# EAGLE design 7inLED-cntr-J010130C (EAGLE 7.7.0)
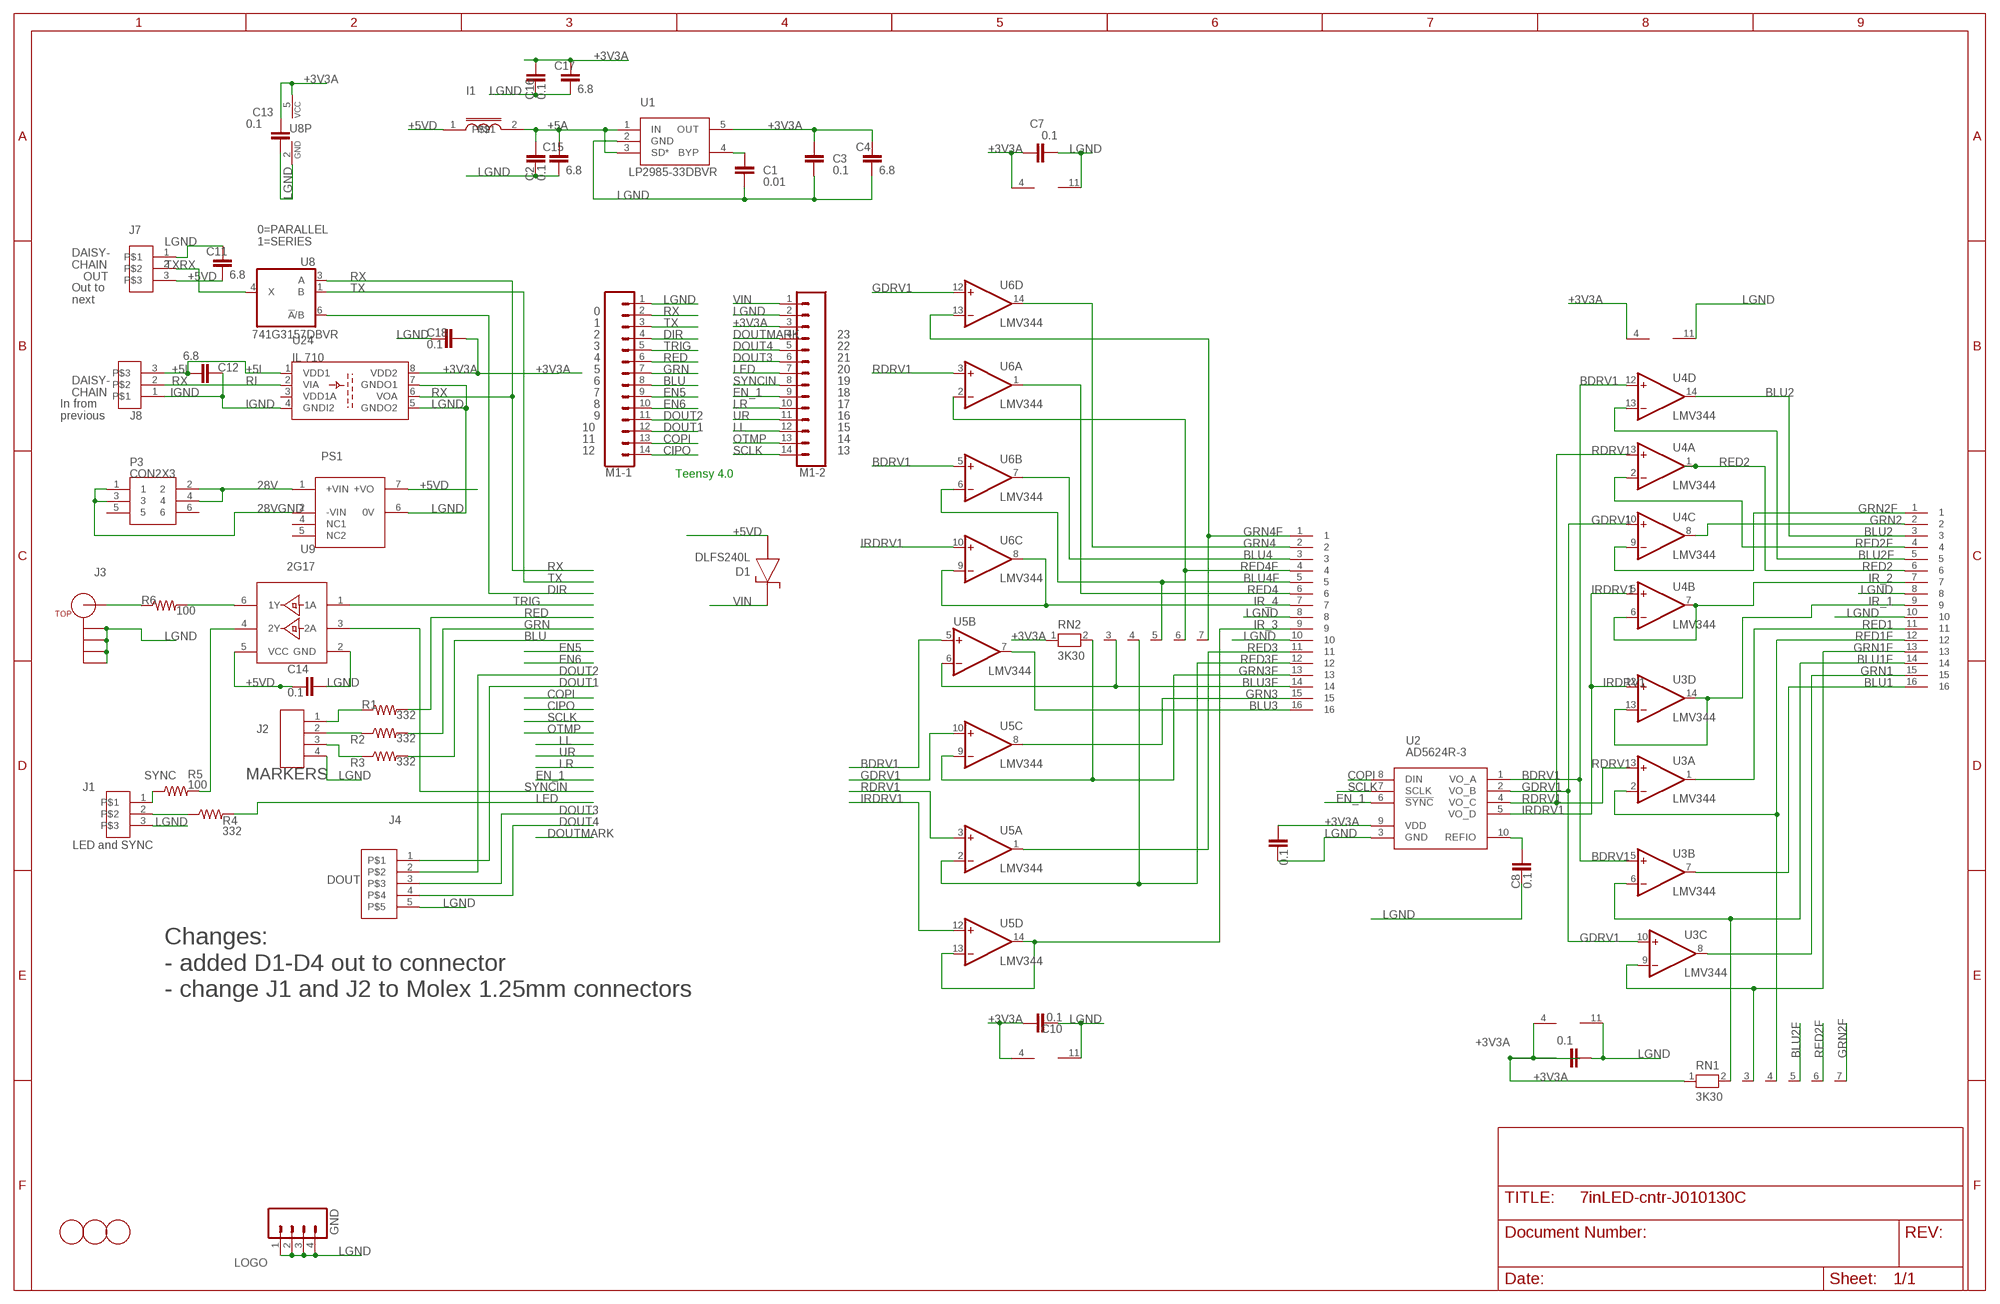
[diagram p0: schematic, sheet 1]

## Parts
C1  0.01  CAPS0805S  [0805S]
C2  0.1  CAPS0603S  [0603S]
C3  0.1  CAPS0603S  [0603S]
C4  6.8  CAPS1206S  [1206S]
C5  0.1  CAPS0603S  [0603S]
C7  0.1  CAPS0603S  [0603S]
C8  0.1  CAPS0603S  [0603S]
C9  0.1  CAPS0603S  [0603S]
C10  0.1  CAPS0603S  [0603S]
C11  6.8  CAPS1210S  [1210S]
C12  6.8  CAPS1210S  [1210S]
C13  0.1  CAPS0603S  [0603S]
C14  0.1  CAPS0603S  [0603S]
C15  6.8  CAPS1206S  [1206S]
C16  0.1  CAPS0603S  [0603S]
C17  6.8  CAPS1206S  [1206S]
C18  0.1  CAPS0603S  [0603S]
D1  DLFS240L  DIODE_SCHOTTKYPWRDI-123  [PWRDI-123]
FID1  FIDUCIAL  [FIDUCIAL_1MM]
FID2  FIDUCIAL  [FIDUCIAL_1MM]
FID3  FIDUCIAL  [FIDUCIAL_1MM]
GND  M04LOCK  [1X04_LOCK]
I1  INDUCTOR0805S  [0805S]
J1  CON3DF13-3TH  [DF13-3P-TH]
J2  CON4DF13-4-TH  [DF13-4-TH]
J3  BNC-4PADBNC-5-1634503-1  [5-1634503-1]
J4  CON5AMPMODU-5  [AMPMODU-5]
J7  CON3AMPMODU-3  [AMPMODU-3]
J8  CON3AMPMODU-3  [AMPMODU-3]
M1-1  CONN_14  [1X14]
M1-2  CONN_14  [1X14]
P1  CON162X8PLUG  [2X8_PLUG]
P2  CON162X8PLUG  [2X8_PLUG]
P3  CON2X3  [2X3_PLUG]
PS1  DC-DCISLTDN-5W  [DC-DC-TDN-5W]
R1  332  RESISTOR_SM0805S  [0805S]
R2  332  RESISTOR_SM0805S  [0805S]
R3  332  RESISTOR_SM0805S  [0805S]
R4  332  RESISTOR_SM0805S  [0805S]
R5  100  RESISTOR_SM0805S  [0805S]
R6  100  RESISTOR_SM0805S  [0805S]
RN1  3K30  RN06  [RN-7]
RN2  3K30  RN06  [RN-7]
U1  LP2985-33DBVR  LT1761-5-SOT23  [SOT23-5]
U2  AD5624R-3  AD56X4R  [MSOP10]
U3  LMV344  QUAD_OPAMPD  [SO14]
U4  LMV344  QUAD_OPAMPD  [SO14]
U5  LMV344  QUAD_OPAMPD  [SO14]
U6  LMV344  QUAD_OPAMPD  [SO14]
U8  741G3157DBVR  [DBV_R-PDSO-G6]
U9  2G17  [SOT23-6]
U24  IL 710  ADUM1100IL710  [MSOP08]
U$2  JFRC-LOGOLOGO_OP  [LOGO_BMP_OP]

## Nets
28V: P3.2 P3.4 PS1.1(+VIN)
28VGND: P3.1 P3.3 PS1.2(-VIN)
+3V3A: C3.1 C4.1 C5.1 C7.1 C9.1 C10.1 C13.1 C16.1 C17.1 C18.1 M1-2.3 RN1.1 RN2.1 U1.5(OUT) U2.9(VDD) U3.4(P:V+) U4.4(P:V+) U5.4(P:V+) U6.4(P:V+) U8.5(VCC) U24.8(VDD2)
+5A: C2.1 C15.1 I1.2 U1.1(IN) U1.3(SD*)
+5I: C12.1 J8.3 U24.1(VDD1)
+5VD: C11.2 C14.1 D1.A I1.1 J7.3 PS1.7(+VO) U9.5(VCC)
BDRV1: U2.1(VO_A) U3.5(B:+IN) U4.12(D:+IN) U5.5(B:+IN) U6.5(B:+IN)
BLU: M1-1.8 R3.2
BLU1: P1.16 U3.7(B:OUT)
BLU1F: P1.14 RN1.2 U3.6(B:-IN)
BLU2: P1.3 U4.14(D:OUT)
BLU2F: P1.5 RN1.5 U4.13(D:-IN)
BLU3: P2.16 U5.7(B:OUT)
BLU3F: P2.14 RN2.3 U5.6(B:-IN)
BLU4: P2.3 U6.7(B:OUT)
BLU4F: P2.5 RN2.5 U6.6(B:-IN)
CIPO: M1-1.14
COPI: M1-1.13 U2.8(DIN)
DIR: M1-1.4 U8.6(!A!/B)
DOUT1: J4.1 M1-1.12
DOUT2: J4.2 M1-1.11
DOUT3: J4.3 M1-2.6
DOUT4: J4.4 M1-2.5
DOUTMARK: M1-2.4
EN5: M1-1.9
EN6: M1-1.10
EN_1: M1-2.9 U2.6(!SYNC)
GDRV1: U2.2(VO_B) U3.10(C:+IN) U4.10(C:+IN) U5.10(C:+IN) U6.12(D:+IN)
GRN: M1-1.7 R2.2
GRN1: P1.15 U3.8(C:OUT)
GRN1F: P1.13 RN1.3 U3.9(C:-IN)
GRN2: P1.2 U4.8(C:OUT)
GRN2F: P1.1 RN1.7 U4.9(C:-IN)
GRN3: P2.15 U5.8(C:OUT)
GRN3F: P2.13 RN2.2 U5.9(C:-IN)
GRN4: P2.2 U6.14(D:OUT)
GRN4F: P2.1 RN2.7 U6.13(D:-IN)
IGND: C12.2 J8.1 U24.4(GNDI2)
IR_1: P1.9 U3.13(D:-IN) U3.14(D:OUT)
IR_2: P1.7 U4.6(B:-IN) U4.7(B:OUT)
IR_3: P2.9 U5.13(D:-IN) U5.14(D:OUT)
IR_4: P2.7 U6.8(C:OUT) U6.9(C:-IN)
IRDRV1: U2.5(VO_D) U3.12(D:+IN) U4.5(B:+IN) U5.12(D:+IN) U6.10(C:+IN)
LED: M1-2.7 R4.2
LGND: C1.2 C2.2 C3.2 C4.2 C5.2 C7.2 C8.2 C9.2 C10.2 C11.1 C13.2 C14.2 C15.2 C16.2 C17.2 C18.2 GND.1 GND.2 GND.3 GND.4 J1.3 J2.4 J3.2A(S1) J3.2B(S2) J3.2C(S3) J3.2D(S4) J4.5 J7.1 M1-1.1 M1-2.2 P1.8 P1.10 P2.8 P2.10 PS1.6(0V) U1.2(GND) U2.3(GND) U3.11(P:V-) U4.11(P:V-) U5.11(P:V-) U6.11(P:V-) U8.2(GND) U9.2(GND) U24.5(GNDO2) U24.7(GNDO1)
LL: M1-2.12
LR: M1-2.10
N$2: R6.2 U9.6(1Y)
N$3: R5.2 U9.4(2Y)
N$4: J2.3 R3.1
N$5: C8.1 U2.10(REFIO)
N$12: C1.1 U1.4(BYP)
N$13: J2.2 R2.1
N$14: J2.1 R1.1
N$15: J3.1(C) R6.1
N$376: J1.2 R4.1
OTMP: M1-2.13
RDRV1: U2.4(VO_C) U3.3(A:+IN) U4.3(A:+IN) U5.3(A:+IN) U6.3(A:+IN)
RED: M1-1.6 R1.2
RED1: P1.11 U3.1(A:OUT)
RED1F: P1.12 RN1.4 U3.2(A:-IN)
RED2: P1.6 U4.1(A:OUT)
RED2F: P1.4 RN1.6 U4.2(A:-IN)
RED3: P2.11 U5.1(A:OUT)
RED3F: P2.12 RN2.4 U5.2(A:-IN)
RED4: P2.6 U6.1(A:OUT)
RED4F: P2.4 RN2.6 U6.2(A:-IN)
RI: J8.2 U24.2(VIA)
RX: M1-1.2 U8.3(A) U24.6(VOA)
SCLK: M1-2.14 U2.7(SCLK)
SYNC: J1.1 R5.1
SYNCIN: M1-2.8 U9.3(2A)
TRIG: M1-1.5 U9.1(1A)
TX: M1-1.3 U8.1(B)
TXRX: J7.2 U8.4(X)
UR: M1-2.11
VIN: D1.K M1-2.1
Unconnected: P3.5 P3.6 PS1.4(NC1) PS1.5(NC2) U24.3(VDD1A)

## Notes on the sheet
- 0=PARALLEL
  1=SERIES
- DAISY-
  CHAIN
- OUT
- Out to 
  next
- 0
- 1
- 2 | 23
- 3 | 22
- 4 | 21
- 5 | 20
- 6 | 19
- DAISY-
  CHAIN
- 7 | 18
- 8 | 17
- In from 
  previous
- 9 | 16
- 10 | 15
- 11 | 14
- 12 | 13
- Teensy 4.0
- MARKERS
- LED and SYNC
- DOUT
- Changes:
  - added D1-D4 out to connector
  - change J1 and J2 to Molex 1.25mm connectors

## Library data of the parts
C1-C5 C7-C18 = STEVES_BU:CAPS
D1 = STEVES_BU:DIODE_SCHOTTKY
FID1-FID3 = adafruit:FIDUCIAL: For use by pick and place machines to calibrate the vision/machine, 1mm By microbuilder.eu
GND = SparkFun:M04: Header 4 Standard 4-pin 0.1" header. Use with straight break away headers (SKU : PRT-00116), right angle break away headers (PRT-00553), swiss pins (PRT-00743), machine pins (PRT-00117), and female headers (PRT-00115). Molex polarized connector foot print use with SKU : PRT-08231 with associated crimp pins and housings.
I1 = STEVES:INDUCTOR
J1 = STEVES_BU:CON3
J2 = STEVES_BU:CON4
J3 = STEVES_BU:BNC-4PAD
J4 = STEVES_BU:CON5
J7 J8 = STEVES_HOME:CON3
M1-1 M1-2 = SparkFun-Connectors:CONN_14: Multi connection point. Often used as Generic Header-pin footprint for 0.1 inch spaced/style header connections On any of the 0.1 inch spaced packages, you can populate with these: Break Away Headers - Straight <https://www.sparkfun.com/products/116> (PRT-00116) Break Away Male Headers - Right Angle <https://www.sparkfun.com/products/553> (PRT-00553) Female Headers <https://www.sparkfun.com/products/115> (PRT-00115) Break Away Headers - Machine Pin <https://www.sparkfun.com/products/117> (PRT-00117) Break Away Female Headers - Swiss Machine Pin <https://www.sparkfun.com/products/743> (PRT-00743) For SCREWTERMINALS and SPRING TERMINALS visit here: Screw Terimnals on SparkFun.com <https://www.sparkfun.com/search/results?term=Screw+Terminals> (5mm/3.5mm/2.54mm spacing) This device is also useful as a general connection point to wire up your design to another part of your project. Our various solder wires solder well into these plated through hole pads. Hook-Up Wire - Assortment (Stranded, 22 AWG) <https://www.sparkfun.com/products/11375> (PRT-11375) Hook-Up Wire - Assortment (Solid Core, 22 AWG) <https://www.sparkfun.com/products/11367> (PRT-11367) View the entire wire category on our website here <https://www.sparkfun.com/categories/141> Special notes: Molex polarized connector foot print use with SKU : PRT-08231 with associated crimp pins and housings. 1MM SMD Version SKU: PRT-10208 NOTES ON THE VARIANTS LOCK and LOCK_LONGPADS... This footprint was designed to help hold the alignment of a through-hole component (i.e. 6-pin header) while soldering it into place. You may notice that each hole has been shifted either up or down by 0.005 of an inch from it's more standard position (which is a perfectly straight line). This slight alteration caused the pins (the squares in the middle) to touch the edges of the holes. Because they are alternating, it causes a "brace" to hold the component in place. 0.005 has proven to be the perfect amount of "off-center" position when using our standard breakaway headers. Although looks a little odd when you look at the bare footprint, once you have a header in there, the alteration is very hard to notice. Also,if you push a header all the way into place, it is covered up entirely on the bottom side.
P1 P2 = STEVES_BU:CON16
P3 = STEVES_BU:CON2X3
PS1 = STEVES_BU:DC-DCISL
R1-R6 = STEVES_BU:RESISTOR_SM
RN1 RN2 = resistor-net:RN06: RESISTOR NETWORK; OC_FARNELL: unknown; OC_NEWARK: unknown
U1 = STEVES_HOME:LT1761-5-SOT23
U2 = STEVES_BU:AD56X4R
U3-U6 = adafruit:QUAD_OPAMP: OP AMP Standard quad package
U8 = 74xx-little-us:74*1G3157: Single-Pole, Double-Throw Analog Switch Source: http://focus.ti.com/lit/ds/symlink/sn74lvc1g3157.pdf
U9 = STEVES_BU:2G17
U24 = STEVES_BU:ADUM1100
U$2 = STEVES_BU:JFRC-LOGO

## Board
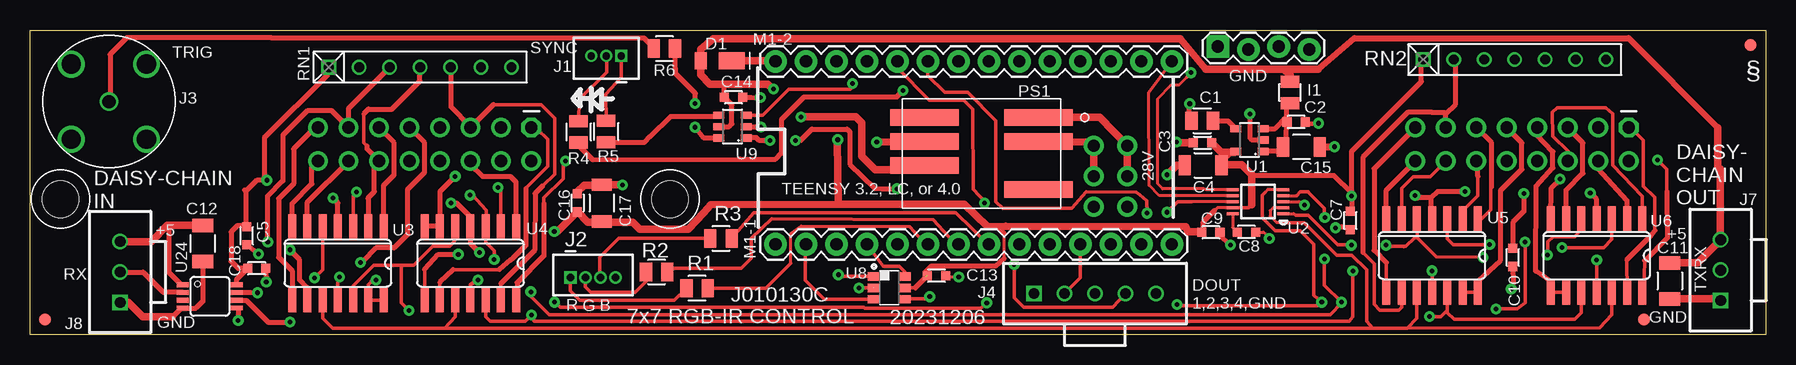
[diagram p1: board, top side]
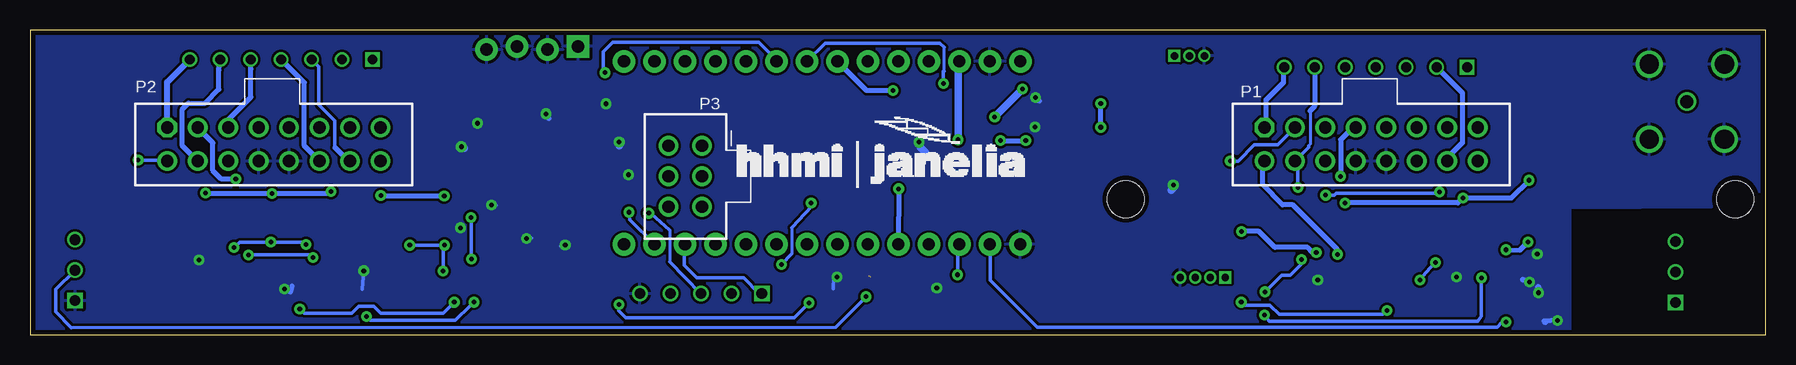
[diagram p2: board, bottom side, seen from below]

Size 144.65 x 25.4 mm. Coordinates in mm from the lower left corner, seen from the top.
Outline: 144.65,0 0,0 0,25.4 144.65,25.4 144.65,0
Copper layers (1*16): Top 0.068mm / dielectric 0.45mm / Bottom 0.068mm
Design rules "default *": minimum track width 8mil, minimum drill 12mil, track to track 8mil, track to pad 8mil, pad to pad 8mil, via to via 8mil, smd to smd 8mil, copper to edge 16mil, drill to drill 8mil, minimum pad ring 8mil, minimum via ring 10mil, stop-mask expansion 4mil, vias tented up to drill 25mil, thermal gap 10mil

### Footprints (pad centres in the part's own frame; a part is rotated, then mirrored left to right if it is on the bottom)
0805S = smd 1.016 x 1.524: 1 -0.889,0; 2 0.889,0
0603S = smd 0.762 x 0.762: 1 -0.762,0; 2 0.762,0
1206S = smd 1.016 x 1.651: 1 -1.524,0; 2 1.524,0
1210S = smd 1.14 x 1.75: 1 -1.5,0; 2 1.5,0
PWRDI-123 = smd 1 x 1.4: A 1.6,0 | smd 2.2 x 1.4: K -1,0
FIDUCIAL_1MM = smd 1 x 1: 1 0,0
1X04_LOCK = drill 1.016 pad 1.88 square: 1 0,0.127 | drill 1.016 pad 1.88: 2 2.54,-0.127; 3 5.08,0.127; 4 7.62,-0.127
DF13-3P-TH = drill 0.6 pad 0.889 square: 1 1.25,0 | drill 0.6 pad 0.889: 2 0,0; 3 -1.25,0
DF13-4-TH = drill 0.6 pad 0.889 square: 1 1.875,0 | drill 0.6 pad 0.889: 2 0.625,0; 3 -0.625,0; 4 -1.875,0
5-1634503-1 = drill 1.1: 1 0,0 | drill 1.6: 2A -3.13,3.13; 2B 3.13,3.13; 2C -3.13,-3.13; 2D 3.13,-3.13
AMPMODU-5 = drill 0.889 square: 1 -5.08,0 | drill 0.889: 2 -2.54,0; 3 0,0; 4 2.54,0; 5 5.08,0
AMPMODU-3 = drill 0.889 square: 1 -2.54,0 | drill 0.889: 2 0,0; 3 2.54,0
1X14 = drill 1.016 pad 1.88: 1 0,0; 2 2.54,0; 3 5.08,0; 4 7.62,0; 5 10.16,0; 6 12.7,0; 7 15.24,0; 8 17.78,0; 9 20.32,0; 10 22.86,0; 11 25.4,0; 12 27.94,0; 13 30.48,0; 14 33.02,0
2X8_PLUG = drill 1.016 pad 1.651 octagon: 1 -1.397,-8.89 | drill 1.016 pad 1.651: 2 1.397,-8.89; 3 -1.397,-6.35; 4 1.397,-6.35; 5 -1.397,-3.81; 6 1.397,-3.81; 7 -1.397,-1.27; 8 1.397,-1.27; 9 -1.397,1.27; 10 1.397,1.27; 11 -1.397,3.81; 12 1.397,3.81; 13 -1.397,6.35; 14 1.397,6.35; 15 -1.397,8.89; 16 1.397,8.89
2X3_PLUG = drill 1.016 pad 1.651: 1 -1.397,-2.54; 2 1.397,-2.54; 3 -1.397,0; 4 1.397,0; 5 -1.397,2.54; 6 1.397,2.54
DC-DC-TDN-5W = smd 5.7 x 1.4: 1 4.75,3; 2 4.75,1; 4 4.75,-3; 5 -4.75,3; 6 -4.75,1; 7 -4.75,-1
RN-7 = drill 0.813 square: 1 -7.62,0 | drill 0.813: 2 -5.08,0; 3 -2.54,0; 4 0,0; 5 2.54,0; 6 5.08,0; 7 7.62,0
4-40SOCKET = hole 3.048: 0,0
SOT23-5 = smd 0.6 x 0.9: 1 -0.95,-1.15; 2 0,-1.15; 3 0.95,-1.15; 4 0.95,1.15; 5 -0.95,1.15
MSOP10 = smd 0.25 x 1: 1 -1,-2.113; 2 -0.5,-2.113; 3 0,-2.113; 4 0.5,-2.113; 5 1,-2.113; 6 1,2.113; 7 0.5,2.113; 8 0,2.113; 9 -0.5,2.113; 10 -1,2.113
SO14 = smd 0.66 x 2.032: 1 -3.81,-3.073; 2 -2.54,-3.073; 3 -1.27,-3.073; 4 0,-3.073; 5 1.27,-3.073; 6 2.54,-3.073; 7 3.81,-3.073; 8 3.81,3.073; 9 2.54,3.073; 10 1.27,3.073; 11 0,3.073; 12 -1.27,3.073; 13 -2.54,3.073; 14 -3.81,3.073
DBV_R-PDSO-G6 = smd 0.69 x 0.99: 1 -0.95,-1.29; 2 0,-1.29; 3 0.95,-1.29; 4 0.95,1.3; 5 0,1.3; 6 -0.95,1.3
SOT23-6 = smd 0.6 x 0.9: 1 -0.95,-1.15; 2 0,-1.15; 3 0.95,-1.15; 4 0.95,1.15; 5 0,1.15; 6 -0.95,1.15
MSOP08 = smd 0.4 x 1: 1 -0.976,-2.263; 2 -0.326,-2.263; 3 0.324,-2.263; 4 0.974,-2.263; 5 0.974,2.262; 6 0.324,2.262; 7 -0.326,2.262; 8 -0.976,2.262

### Placement (x,y rotation side)
C1  97.69,17.83 180 top
C2  105.51,17.73 0 top
C3  97.71,16 180 top
C4  97.76,14.12 180 top
C5  18.06,8.25 270 top
C7  110.03,9.53 270 top
C8  101.37,8.56 0 top
C9  98.4,8.53 0 top
C10  123.57,6.45 270 top
C11  136.65,4.5 90 top
C12  14.4,7.62 270 top
C13  75.54,4.93 0 top
C14  58.62,19.79 0 top
C15  105.94,15.65 0 top
C16  45.62,11 90 top
C17  47.65,10.97 90 top
C18  18.9,5.54 0 top
D1  57.48,22.83 180 top
FID1  143.38,24.13 180 top
FID2  1.27,1.27 90 top
FID3  134.49,1.27 90 top
GND  98.98,23.9 0 top
I1  105,20.19 270 top
J1  48.03,23.24 0 top
J2  46.91,4.78 180 top
J3  6.58,19.43 0 top
J4  88.75,3.43 0 top
J7  140.89,5.38 90 top
J8  7.52,5.23 90 top
M1-1  62.13,7.54 0 top
M1-2  62.13,22.78 0 top
P1  32.89,15.87 270 bottom
P2  124.33,15.87 270 bottom
P3  90.04,13.21 180 bottom
PS1  79.3,15.11 0 top
R1  55.6,3.89 0 top
R2  52.22,5.23 0 top
R3  57.58,8.03 0 top
R4  45.72,16.92 270 top
R5  48.01,16.94 270 top
R6  52.86,23.85 0 top
RN1  32.51,22.3 0 top
RN2  123.72,22.94 0 top
S1  SCREW  [4-40SOCKET]  2.54,11.3 90 top
S8  SCREW  [4-40SOCKET]  53.34,11.3 90 top
U1  101.63,16.23 90 top
U2  102.34,11.1 90 top
U3  25.65,5.97 180 top
U4  36.7,5.97 180 top
U5  116.84,6.6 180 top
U6  130.56,6.6 180 top
U8  71.6,3.91 270 top
U9  58.55,17.35 90 top
U24  14.99,3.2 270 top
U$2  75.59,13.72 0 bottom

### Tracks (layer width: path | path; a pad name or v marks a point on that pad's centre or on a via)
28V
  Top 0.61: P3.4 P3.2 89.13,18.14 PS1.1
28VGND
  Top 0.61: P3.3 P3.1 88.25,16.06 PS1.2
+3V3A  (via drill 0.38)  (1 unrouted)
  Top 0.254: U2.9 98.94,10.6 98.7,10.36 | 81.18,6.38 81.18,8.46
  Top 0.305: U2.9 101.56,10.6 101.8,10.85 | U8.5 73.79,3.91
  Top 0.406: 98.7,10.36 98.7,10.34 97.74,9.37 97.74,8.64 C9.1 | 100.41,15.21 U1.5 | U3.4 25.65,11 v25.25,11.4 | 17.98,11.96 18.9,12.88 v19.74,12.88 19.53,13.08 19.53,16.41 24.84,21.72 24.84,22.25 RN1.1 | 17.98,11.96 17.98,9.09 | 17.98,9.09 C5.1 | v35.08,10.97 35.56,10.97 36.7,9.83 U4.4 36.7,7.62 v37.46,6.86 | U6.4 130.56,11.28 v130.02,11.81 | v124.48,11.79 124.48,10.29 123.57,9.37 C10.1 | v119.58,11.94 117.3,11.94 116.76,11.4 | 116.76,11.4 116.74,11.38 116.74,9.78 U5.4 | 116.76,11.4 115.62,11.4 v115.42,11.61 | v110.13,11.56 110.13,10.39 C7.1 | v110.13,11.56 110.13,15.29 115.95,21.11 115.95,22.78 RN2.1 | v110.13,11.56 110.13,11.79 108.66,13.26 101.91,13.26 101.8,13.36 | 17.88,12.06 17.98,11.96 | U24.8 17.25,4.65 C18.1 17.35,5.54 16.76,6.12 16.76,8.58 17.27,9.09 17.98,9.09 | 67.28,16.23 v67.31,16.26 | 73.79,3.91 C13.1 | 74.6,4.85 74.6,5.21 75.13,5.74 80.47,5.74 81.18,6.38 | 81.18,8.46 80.72,9.02
  Top 0.61: 101.8,10.85 101.8,13.36 101.78,13.36 100.97,14.17 99.34,14.17 C4.1 99.29,14.53 99.97,15.21 | 100.41,15.21 99.97,15.21 | 99.97,15.21 99.26,15.21 C3.1 | 67.77,10.9 56.72,10.85 56.13,10.19 54.84,8.81 50.8,8.81 50.22,9.4 47.7,9.4 C17.1 47.6,9.4 46.48,9.4 45.64,10.24 C16.1 43.99,8.61 v43.69,8.61 | 67.77,10.9 77.06,10.87 77.85,10.87 79.78,9.04 80.72,9.02 81.33,9.04 96.32,9.02 96.49,8.58 97.59,8.58 C9.1 | 67.28,16.23 67.33,10.94 67.77,10.9
  Bottom 0.406: v19.74,12.88 21.21,11.4 v25.25,11.4 25.65,11 35.05,11 v35.08,10.97 | v130.02,11.81 124.51,11.81 v124.48,11.79 119.74,11.79 v119.58,11.94 | v115.42,11.61 110.19,11.61 v110.13,11.56 | v37.46,6.86 37.74,6.86 38.18,7.29 40.92,7.29 42.24,8.61 v43.69,8.61
  Bottom 0.61: v67.31,16.26 67.31,22.23 M1-2.3
+5A
  Top 0.406: U1.1 104.26,15.28 104.7,15.72 104.7,16.41 C2.1 104.75,18.16 | 104.75,18.16 104.75,19.05 I1.2 104.77,19.08 | U1.3 103.77,17.18 104.75,18.16
  Top 0.61: C15.1 104.14,15.16 104.26,15.28
+5I
  Top 0.406: U24.1 12.59,4.18 11.61,5.16 11.61,8.89 11.84,9.12
  Top 0.61: J8.3 10.11,7.77 11.45,9.12 11.84,9.12 C12.1
+5VD  (via drill 0.38)
  Top 0.406: U9.5 58.27,17.35 58.5,17.58 58.5,19.15 | 58.5,19.15 C14.1 | 58.5,19.15 58.5,19.23 57.86,19.86 57.86,20.85 56.64,20.89
  Top 0.508: 107.34,22.15 110.36,24.71 133.22,24.71 140.66,17.27
  Top 0.61: 107.34,22.15 104.5,22.15 | I1.1 105,21.64 104.5,22.15 | 104.5,22.15 97.99,22.15 95.86,24.66 56.92,24.69 55.88,23.8 55.88,22.99 D1.A 55.91,21.68 56.64,20.89 61.48,20.89 v61.95,20.47 | 140.66,17.27 140.66,14.02 140.84,13.84 140.84,7.98 J7.3 138.97,6 C11.2 | v64.26,18.16 68.81,18.16 69.32,17.65 69.32,14.86 70.43,13.74 74.54,13.74 PS1.7
  Bottom 0.61: v64.26,18.16 v61.95,20.47 | v61.95,20.47 61.92,20.5 | 62,20.45 61.92,20.5 | 61.92,20.5 61.98,20.5 v61.95,20.47
BDRV1  (via drill 0.38)
  Top 0.254: U2.1 105.29,10.1 105.46,9.96
  Top 0.305: 115.59,8.1 115.59,9.65 U5.5 | 115.59,8.1 115.39,8.1 114.66,7.37 114.45,7.37 | 114.45,7.37 113.03,7.37 v113,7.47 | U6.5 129.29,8.66 129.18,8.66 128.73,8.18 126.95,8.18 126.49,7.75 126.49,6.71 v126.44,6.65 | v121.08,6.45 117.2,6.5 115.59,8.1 | U3.5 24.38,5.41 v23.7,4.75 | 105.46,9.96 106.5,9.96 108.97,7.49 110.08,7.49 v110.11,7.47 | 114.48,7.34 114.45,7.37 | v110.24,5.31 110.24,1.5 109.93,1.12 57.2,1.12 47.12,1.14 42.04,1.14 v41.78,1.65 41.27,1.14 38.35,1.14 37.97,1.52 U4.12
  Bottom 0.305: v113,7.47 v110.11,7.47 110.24,7.34 v110.24,5.31 | v126.44,6.65 121.41,6.65 v121.08,6.45 | v23.7,4.75 23.72,1.55 24,1.14 41.4,1.14 v41.78,1.65
BLU
  Top 0.305: M1-1.8 79.88,7.49 77.16,10.16 60.32,10.16 R3.2
BLU1
  Top 0.406: U3.7 21.84,10.92 23.49,12.57 23.49,13.97 P1.16
BLU1F
  Top 0.406: U3.6 23.11,11.05 P1.14
  Bottom 0.406: P1.14 26.54,14.76 25.3,16 25.3,16.03 25.27,16.05 25.27,20.14 RN1.2
BLU2  (via drill 0.38)
  Top 0.305: 40.61,3.3 40.61,3 U4.14 | 42.82,10.95 42.82,11.4 44.42,13 44.42,14.28 v44.63,14.48
  Top 0.406: 42.82,10.95 42.82,6.58 40.59,4.34 40.61,3.3
  Bottom 0.305: v44.63,14.48 43.97,14.48 42.62,15.82 40.69,15.82 P1.3
BLU2F
  Top 0.305: 39.24,4.27 U4.13 | 42.72,12.42 42.75,12.42 43.71,13.39 43.71,18.06 42.6,19.18 38.61,19.18
  Top 0.406: 42.72,12.42 42.09,11.79 42.06,7.06 39.24,4.27 | 38.61,19.18 38.23,18.8 P1.5 36.7,17.4 35.1,19 35.1,22.25 RN1.5
BLU3
  Top 0.406: U5.7 113.03,12.06 P2.16
BLU3F
  Top 0.305: U5.6 114.3,12.19 115.29,13.18 116.69,13.18 P2.14
  Bottom 0.305: 119.25,15.62 119.25,17.86 120.57,19.18 120.57,22.33 RN2.3
  Bottom 0.406: P2.14 118.11,14.48 119.25,15.62
BLU4  (via drill 0.38)
  Top 0.406: U6.7 126.77,12.24 v127.51,12.98
  Bottom 0.406: v127.51,12.98 128.7,12.98 129.41,13.69 129.41,16 P2.3
BLU4F
  Top 0.406: U6.6 128.02,12.06 129.41,13.46 129.41,16 P2.5
  Bottom 0.406: P2.5 128.14,17.91 126.24,19.81 126.24,22.15 RN2.5
COPI  (via drill 0.38)
  Top 0.254: U2.8 96.82,11.1
  Top 0.305: 96.82,11.1 95.63,11.07 v94.74,10.21
  Bottom 0.305: v94.74,10.21 94.67,9.6 M1-1.13
DIR
  Top 0.305: M1-1.4 71.12,5.71 72.44,5.71 72.9,5.25 U8.6
DOUT1
  Bottom 0.305: J4.1 83.87,3.43 85.19,4.75 89.08,4.75 90.14,5.82 90.14,7.47 M1-1.12
DOUT2
  Top 0.305: M1-1.11 87.53,4.75 J4.2
DOUT3  (via drill 0.38)
  Top 0.305: M1-2.6 74.83,21.59 76.22,20.19 78.13,20.19 80.49,17.83 80.49,11.1 81.05,10.57 86.82,10.57 88.04,11.91 92.2,11.89 92.48,11.68 93.07,11.15 v93.09,10.13
  Bottom 0.254: 91.34,8.71 91.34,6.1
  Bottom 0.305: v93.09,10.13 92.86,10.08 91.34,8.71 | 91.34,6.1 J4.3
DOUT4  (via drill 0.38)
  Top 0.305: M1-2.5 72.31,22.76 72.31,22.2 74.95,19.56 77.8,19.56 78.56,18.8 78.59,12.12 79.58,11.07 79.58,10.97 v79.55,10.97 | v82.02,5.87 82.02,3.07 82.83,2.29 90.22,2.29 J4.4
  Bottom 0.254: 81.18,8.94 81.18,6.76
  Bottom 0.305: v79.55,10.97 79.53,10.69 81.18,8.94 | 81.18,6.76 v82.02,5.87
EN_1  (via drill 0.38)
  Top 0.254: U2.6 97.96,12.1 97.76,12.17 94.39,12.17 93.98,12.57 93.98,19.69 95.12,20.83 95.76,20.83 96.39,21.46
  Top 0.305: v96.75,21.84 96.75,21.82 96.39,21.46
  Bottom 0.305: M1-2.9 82.45,22.91 83.92,24.38 96.09,24.38 96.88,23.6 96.88,21.97 v96.75,21.84
GDRV1
  Top 0.254: U2.2 103.61,10.6 103.35,10.34 103.35,9.91 103.86,9.4 104.55,9.4 104.6,9.35
  Top 0.305: 104.6,9.35 106.2,9.35 108.91,6.63 110.16,6.63 111.38,5.41 111.38,1.14 111.89,0.56 | U3.10 24.38,1.4 25.22,0.56 34.54,0.56 | 34.54,0.56 35.43,1.52 U4.10 | 34.54,0.56 111.89,0.56 | 111.89,0.56 114.78,0.56 | 114.78,0.56 115.57,1.4 U5.10 | U6.12 131.83,1.65 130.81,0.58 114.78,0.56
GRN
  Top 0.305: M1-1.7 77.34,7.31 75.26,9.6 61.82,9.65 60.1,8.03 60.1,6.38 59.28,5.56 58.17,5.56 53.64,5.54 R2.2
GRN1
  Top 0.406: U3.8 21.84,5.33 20.73,6.45 20.73,11.35 21.97,12.57 21.97,15.49 23.62,17.15 23.88,17.15 P1.15
GRN1F  (via drill 0.38)
  Top 0.406: U3.9 23.11,3.94 22.48,4.57 22.48,6.25 v21.67,7.09 | v19.81,7.75 19.81,11.56 21.08,12.83 21.08,16.64 23.11,18.67 25.15,18.67 P1.13 26.54,18.87 RN1.3
  Bottom 0.406: v21.67,7.09 20.5,7.06 v19.81,7.75
GRN2  (via drill 0.38)
  Top 0.305: 32.89,5.46 U4.8
  Top 0.406: 32.89,5.46 34.04,6.71 v35.69,6.71
  Bottom 0.406: v35.69,6.71 35.71,7.11 39.42,10.82 40.26,10.82 41.93,12.55 41.91,14.48 P1.2
GRN2F
  Top 0.305: 39.12,5.44 35.25,5.44 | 34.16,4.37 U4.9 | 41.33,12.19 41.33,12.22 43.15,14.05 43.15,16.28 42.29,17.15
  Top 0.406: 41.33,12.19 41.33,7.44 40.23,6.38 40.08,6.25 39.12,5.44 | 35.25,5.44 34.16,4.37 | 42.29,17.15 41.91,17.15 P1.1
  Bottom 0.406: P1.1 41.66,17.4 41.66,19.53 41.66,19.56 40.18,21.03 40.18,22.25 RN1.7
GRN3
  Top 0.305: 113.03,6.02 U5.8
  Top 0.406: 113.03,6.02 112.01,7.04 112.01,13.84 115.32,17.15 P2.15
GRN3F
  Top 0.305: 111.07,6.86 111.12,6.81 112.01,5.92 112.01,2.54 112.5,2.06 114.07,2.06 114.3,2.29 U5.9
  Top 0.406: 111.07,6.86 111.07,14.78 114.81,18.54 116.84,18.54 117.86,18.54 117.98,18.42 | P2.13 117.98,18.42 | 117.98,18.42 118.8,19.23 118.8,22.78 RN2.2
GRN4  (via drill 0.38)
  Top 0.305: 134.54,6.17 134.49,3.66 U6.14 | 136.4,11.94 136.4,13.79 v135.64,14.55
  Top 0.406: 136.4,11.94 136.45,8.08 134.54,6.17
  Bottom 0.305: v135.64,14.55 133.3,14.55 P2.2
  Bottom 0.406: P2.2 133.48,14.48
GRN4F
  Top 0.305: 133.07,6.25 U6.13 | P2.1 133.38,17.27 134.44,16.21 134.44,12.39 135.38,11.46 135.41,8.69
  Top 0.406: 133.07,6.25 135.1,8.28 135.41,8.69
  Bottom 0.508: P2.1 133.22,21.06 RN2.7
IGND
  Top 0.406: 11.84,1.45 12.61,2.23 U24.4 13.83,2.23 13.84,2.24 14.4,2.79 C12.2
  Top 0.61: J8.1 8.2,2.69 9.4,1.5 11.79,1.5 11.84,1.45
IR_1  (via drill 0.38)
  Top 0.305: 27.71,6.12 27.69,6.15 v27.53,6.02 | v28.83,4.57 28.57,4.57 28.19,4.19 U3.13 U3.14
  Top 0.406: 27.71,6.12 28.83,7.24 30.35,7.24 31.5,8.38 31.5,12.14 32.89,13.54 32.89,16 P1.9
  Bottom 0.305: v27.53,6.02 27.99,5.54 v28.83,4.57
IR_2  (via drill 0.38)
  Top 0.406: v35.43,13.21 34.16,11.94 U4.6 U4.7
  Bottom 0.406: P1.7 34.42,17.27 35.43,16.26 v35.43,13.21
IR_3
  Top 0.305: 120.65,4.44 U5.14 U5.13
  Top 0.406: 120.65,4.44 122.55,6.22 122.55,12.04 124.33,13.79 124.33,16 P2.9
IR_4
  Top 0.305: U6.9 127.91,3.53 127.89,3.56 126.77,3.56 U6.8 126.75,4.44
  Top 0.406: 126.75,4.44 125.48,5.33 125.5,12.39 126.9,13.92 126.9,15.26 125.55,16.69 125.6,16.74 P2.7
IRDRV1  (via drill 0.38)
  Top 0.254: U2.5 103.13,12.1 102.92,11.89
  Top 0.305: U3.12 26.92,4.09 28.63,5.79 30.94,5.79 | 30.94,5.79 31.98,5.79 33.58,7.39 34.98,7.39 35.41,7.82 35.41,9.02 U4.5 | U6.10 129.29,1.85 128.73,1.3 118.67,1.3 118.11,1.85 U5.12 118.11,2.06 117.55,1.5 116.74,1.5 116.66,1.55 v116.61,1.52 | 30.94,5.79 30.94,2.67 v31.57,2.03 | v43.71,2.72 43.76,2.72 44.2,2.29 69.49,2.29 69.57,2.21 79.22,2.21 v79.73,2.67 | 102.92,11.89 102.92,11.86 102.69,11.63 102.69,9.75 103.78,8.66 105.84,8.66 106.96,7.54 106.98,3.28 v107.64,2.72 107.57,2.72 107.29,2.44 95.66,2.44 v95.58,2.51
  Bottom 0.305: v31.57,2.03 31.6,2.03 31.93,1.7 40.56,1.7 41.33,2.46 43.71,2.46 v43.71,2.72 | v107.64,2.72 107.97,2.44 109.22,1.19 116.31,1.19 v116.61,1.52 | v95.58,2.51 95.58,2.01 95,1.42 80.97,1.42 v79.73,2.67
LED  (via drill 0.38)
  Top 0.254: R4.2 45.69,15.8
  Top 0.406: 45.69,15.8 46.89,14.6 59.18,14.63 62.13,14.63 62.66,15.16 62.66,17.98 64.52,19.84 72.24,19.84 v72.75,20.35
  Bottom 0.406: v72.75,20.35 74.93,20.35 M1-2.7
LGND  (via drill 0.38)
  Top 0.254: U2.3 105.77,11.1 v106.2,10.82 | C8.2 102.79,8.56 v103.28,8.03
  Top 0.305: U3.11 25.65,4.7 v25.78,4.83 | 36.7,2.67 U4.11 36.7,4.19 v37.34,4.57 | U6.11 v130.56,6.22 | U5.11 v116.84,5.33 | C13.2 76.25,4.8 v77.39,4.83 | U8.2 v69.09,3.91
  Top 0.406: C10.2 123.6,4.34 v123.44,3.81 | C7.2 109.35,8.99 v108.79,8.91 | C9.2 99.24,8.15 v100.05,7.49 | C1.2 96.6,18.62 v96.65,19.25 | U1.2 101.83,16.23 101.68,16.38 101.68,18.39 v101.65,18.42 | C2.2 106.32,17.58 v107.37,17.63 | U9.2 60.88,17.35 v60.91,17.32 | C14.2 60.1,19.79 v60.86,19.76 | C5.2 v19.05,6.73 | U24.7 18.38,3.53 v18.95,3.5 | U24.5 17.36,2.2 v17.35,1.19 | C18.2 19.66,5.41 v19.68,4.39
  Top 0.61: C4.2 95.55,14.12 v94.77,13.33 | C3.2 95.63,16 v95.55,16.08 | C15.2 v108.71,15.67 | C11.1 140.74,3 J7.1 | PS1.6 70.6,16.06 v70.56,16.05 | C16.2 45.62,11.91 46.18,12.47 47.62,12.47 C17.2 49.35,12.5 v49.38,12.47
  Bottom 0.254: v106.2,10.82 105.84,10.82 105.79,10.77 | v103.28,8.03 102.82,8.08
  Bottom 0.305: v25.78,4.83 25.65,4.83 | v116.84,5.33 116.97,3.81 | v77.39,4.83 77.67,4.8 77.72,3.83 | v69.09,3.91 69.06,3.91
  Bottom 0.406: v123.44,3.81 122.94,3.56 122.81,4.06 | v130.56,6.22 130.43,6.22 | v108.79,8.91 108.86,8.94 108.76,8.84 | v100.05,7.49 100.38,7.42 99.8,7.57 | v96.65,19.25 96.8,19.38 96.57,19.15 | v101.65,18.42 101.65,18.26 101.42,18.03 | v107.37,17.63 107.26,17.42 107.34,17.42 | v60.91,17.32 60.91,17.2 | v60.86,19.76 60.53,19.48 | v19.05,6.73 18.92,6.73 | v18.95,3.5 19,4.04 18.92,3.96 | v17.35,1.19 18.49,1.14 18.36,1.02 | v19.68,4.39 20.29,4.62 20.24,4.57
  Bottom 0.61: v94.77,13.33 94.67,13.33 94.74,13.28 | v95.55,16.08 95.55,15.77 95.5,16.13 | v108.71,15.67 108.48,15.54 | v70.56,16.05 70.46,15.65 70,15.19 | v49.38,12.47 49.38,12.19 49.53,12.04
  pour Bottom: 26.49,-2.18 16.28,-1.98 16.31,10.59 -1.4,10.69 -0.97,26.9 153.24,27.25 153.29,4.78 152.98,-1.68
N$2  (via drill 0.38)
  Top 0.406: U9.6 56.15,16.4 v55.42,17.3 | v55.42,19.28 55.45,19.36 55.45,20.12 53.8,21.77 R6.2
  Bottom 0.406: v55.42,17.3 v55.42,19.28
N$3
  Top 0.254: 57.31,18.21 U9.4
  Top 0.406: R5.2 51.23,16.05 51.69,16.54 53.39,18.21 56.59,18.21 57.31,18.21
N$4
  Top 0.305: J2.3 47.5,4.82 47.5,5.44 47.5,6.45 49.07,8.03 R3.1
N$5
  Top 0.254: U2.10 100.22,8.95 C8.1
N$12
  Top 0.406: C1.1 99.82,17.83 U1.4
N$13
  Top 0.305: R2.1 51.33,4.44 50.44,3.56 46.74,3.56 46.28,4.01 J2.2
N$14
  Top 0.305: J2.1 45.04,3.65 45.82,2.87 53.7,2.87 R1.1
N$15
  Top 0.406: R6.1 52.07,23.83 51.16,24.74 20.07,24.77 14.2,24.77 11.99,24.77 8.08,24.77 6.68,23.37 6.68,19.53 J3.1 | R6.1 51.87,23.88 R6.1
N$376
  Top 0.305: R4.1 45.77,19.61 48.06,21.87 48.06,23.22 J1.2
RDRV1  (via drill 0.38)
  Top 0.254: U2.4 105.53,11.6
  Top 0.305: U6.3 131.83,7.98 131.17,7.26 v127.66,7.26 | v121.64,7.52 118.59,7.52 118.11,8 U5.3 | U3.3 26.92,11.58 v27.2,11.91 | v36.68,11.63 36.85,11.66 38.02,10.39 38.02,9.09 U4.3 37.97,7.72 38.68,7.01 v38.68,6.27 | 105.53,11.6 105.55,11.6 105.87,11.91 106.53,11.91 106.53,11.89 107.87,10.54 v107.9,9.78 | v41.73,3.58 41.73,3.23 43.26,1.68 108.36,1.68 109.3,2.67 v109.3,2.72 107.87,4.14 v107.87,6.33 | v122.17,2.16 123.95,2.16 124.59,2.67 v124.59,7.75
  Bottom 0.305: v127.66,7.26 127.51,7.37 127.18,7.7 124.59,7.7 | 124.59,7.7 121.94,7.7 v121.64,7.52 | v27.2,11.91 27.36,11.89 27.43,11.81 35.79,11.81 35.97,11.63 v36.68,11.63 | v38.68,6.27 38.71,5.89 39.65,4.95 40.36,4.95 v41.73,3.58 | 107.92,9.73 v107.9,9.78 107.9,6.78 v107.87,6.33 | v109.3,2.72 110.24,1.78 115.44,1.78 116.03,2.36 117.27,2.36 117.86,1.78 121.79,1.78 v122.17,2.16 | 124.59,7.7 v124.59,7.75
RED
  Top 0.254: 63.4,5.97 63.4,8.43 64.29,9.04
  Top 0.305: M1-1.6 74.8,7.34 73.33,9.02 64.29,9.04 | R1.2 61.32,3.89 63.4,5.97
RED1
  Top 0.406: U3.1 29.46,12.45 30.35,13.33 30.35,16 P1.11
RED1F
  Top 0.305: 27.81,18.42 27.81,16 28.07,15.75
  Top 0.406: U3.2 28.19,11.3 28.19,11.43 28.7,11.94 28.7,14.1 P1.12 28.07,15.49 28.07,15.75 | 27.81,18.42 28.19,18.8 30.15,18.8 32.49,21.13 32.49,22.28 RN1.4
RED2
  Top 0.406: P1.6 36.7,14.22 37.72,13.21 40.03,13.21 40.49,12.75 40.49,9.07 U4.1
RED2F  (via drill 0.38)
  Top 0.305: U4.2 39.22,12.17 v38.99,12.27
  Bottom 0.254: 37.97,18.67 37.97,15.87 38.1,15.75
  Bottom 0.305: v38.99,12.27 38.99,14.22 P1.4 38.1,15.62 38.1,15.75
  Bottom 0.406: RN1.6 37.59,19.05 37.97,18.67
RED3
  Top 0.305: U5.1 120.98,9.68 121.74,10.44 121.74,12.27 121.79,12.32
  Top 0.406: 121.79,12.32 121.79,16 P2.11
RED3F
  Top 0.305: U5.2 119.38,10.34 120.65,11.61 120.65,13.21
  Top 0.406: 120.65,13.21 120.65,14.35 P2.12
  Bottom 0.406: P2.12 121.79,15.75 121.79,21.01 RN2.4
RED4
  Top 0.305: P2.6 128.17,15.29 126.9,16.56 126.87,18.54 127.25,18.92 131.32,18.92 131.88,18.44 131.88,14.12 134.37,11.56 U6.1
RED4F
  Top 0.406: U6.2 133.1,11.18 130.68,13.84 P2.4
  Bottom 0.406: P2.4 131.95,15.75 131.95,18.8 131.44,19.3 130.05,19.3 128.91,20.45 128.91,22.07 RN2.6
RI
  Top 0.406: J8.2 9.42,5.23 11.07,3.58 11.13,3.53 U24.2
RX  (via drill 0.38)
  Top 0.305: U8.3 66.2,2.96 64.62,4.55 64.62,7.09 M1-1.2
  Top 0.406: U24.6 18.03,2.88 19.86,1.04 21.64,1.04 v21.67,1.07
  Bottom 0.305: v21.67,1.07 21.95,1.07 22.38,0.64 60.71,0.64 64.62,4.55 64.62,7.09 M1-1.2
SCLK
  Top 0.254: U2.7 94.11,11.6 93.27,12.45 93.24,20.22 M1-2.14
SYNC
  Top 0.305: J1.1 49.28,21.44 47.98,20.07 R5.1
SYNCIN  (via drill 0.38)
  Top 0.305: U9.3 61.07,18.3 63.25,20.45 68.35,20.46 68.48,20.59 68.48,20.6 v68.53,20.96
  Bottom 0.254: 68.48,21.97 68.48,23.98
  Bottom 0.305: v68.53,20.96 68.53,21.95 68.48,21.97 | 68.48,23.98 68.83,24.31 78.38,24.31 M1-2.8
TRIG  (via drill 0.38)
  Top 0.406: v63.78,16.18 64.24,16.21 65.15,17.15 68.1,17.15 68.33,16.92 68.33,14.22 70.38,12.19 70.99,12.17 v72.26,12.17 | v61.67,16.18 60.78,16.18 60.53,16.43 59.73,16.43 U9.1
  Bottom 0.406: v63.78,16.18 v61.67,16.18 | v72.26,12.17 M1-1.5
TX  (via drill 0.38)
  Top 0.305: U8.1 67.5,4.86 v67.36,5
  Bottom 0.305: v67.36,5 67.36,6.93 M1-1.3
TXRX  (via drill 0.38)
  Top 0.305: v74.98,3.17 74.88,3.17 74.7,3 72.94,3 U8.4
  Bottom 0.305: J7.2 142.49,3.79 142.49,1.91 141.2,0.58 77.49,0.64 v74.98,3.17
VIN
  Top 0.61: D1.K 61.62,22.84 M1-2.1

### Text on the board
tPlace: SYNC | TRIG | S | S | 28V | TEENSY 3.2, LC, or 4.0 | DAISY-CHAIN / IN | DAISY- / CHAIN / OUT | +5 | +5 | RX | TXRX | J010130C | DOUT / 1,2,3,4,GND | R | G | B | GND | GND | 7x7 RGB-IR CONTROL | 20231206